# Altium schematic sheet Deploy_Switches.SchDoc: SPEX - INTERFACE - SWITCHES
size A4; Author: Derek Belsky; Revision: 0; SheetNumber: 4; SheetTotal: 6
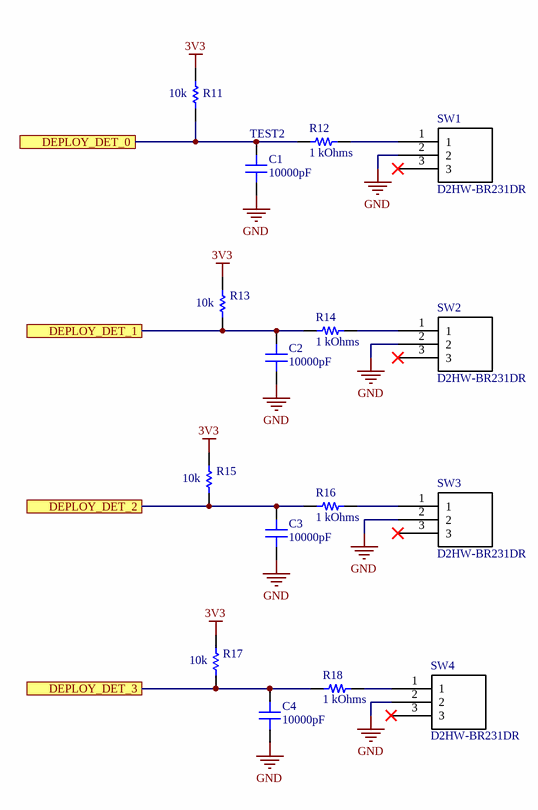
[diagram p0: Deploy_Switches.SchDoc]

## Parts
C1  10000pF  [CAP 0603_1608]
C2  10000pF  [CAP 0603_1608]
C3  10000pF  [CAP 0603_1608]
C4  10000pF  [CAP 0603_1608]
R11  value 10k  [RES 0603_1608]  (hidden comment: 1 kOhms)
R12  1 kOhms  [RES 0603_1608]
R13  value 10k  [RESC1609X50X30NL8T20]  (hidden comment: CRCW060310K0FKEA)
R14  1 kOhms  [RES 0603_1608]
R15  value 10k  [RES 0603_1608]  (hidden comment: 1 kOhms)
R16  value 1 kOhms  [RESC1609X50X30NL8T20]  (hidden comment: CRCW060310K0FKEA)
R17  value 10k  [RES 0603_1608]  (hidden comment: 1 kOhms)
R18  value 1 kOhms  [RESC1609X50X30NL8T20]  (hidden comment: CRCW060310K0FKEA)
SW1  D2HW-BR231DR
SW2  D2HW-BR231DR
SW3  D2HW-BR231DR
SW4  D2HW-BR231DR

## Ports
DEPLOY_DET_0, DEPLOY_DET_1, DEPLOY_DET_2, DEPLOY_DET_3

## Nets
3V3: R11.2 R13.2 R15.2 R17.2
GND: C1.1 C2.1 C3.1 C4.1 SW1.2 SW2.2 SW3.2 SW4.2
DEPLOY_DET_0: C1.2 R11.2 R12.1 ; port DEPLOY_DET_0
DEPLOY_DET_1: C2.2 R13.1 R14.1 ; port DEPLOY_DET_1
DEPLOY_DET_2: C3.2 R15.2 R16.1 ; port DEPLOY_DET_2
DEPLOY_DET_3: C4.2 R17.2 R18.1 ; port DEPLOY_DET_3
NetR12_2: R12.2 SW1.1
NetR14_2: R14.2 SW2.1
NetR16_2: R16.2 SW3.1
NetR18_2: R18.2 SW4.1

Not connected (* = marked no-connect by the designer): SW1 3*; SW2 3*; SW3 3*; SW4 3*

## Notes on the sheet
- (near C1) TEST2
- Title
- Size:
- Date:
- A4
- Author:
- Time:
- Sheet
- Revision:
- of
- RIT Space Exploration Team
- Rochester Institute of Technology
- 1 Lomb Memorial Drive
- Rochester, NY 14623
- https://spex.rit.edu
- File:

## Library data of the parts
C1-C4 = C0603S103K4RACTU: CAP CER 10000PF 16V X7R 0603; Manufacturer: KEMET; Tolerance: ±10%; Part Number: C0603S103K4RACTU; Value: 10000pF; Applications: Boardflex Sensitive; Capacitance: 10000pF; ComponentLink1Description: Datasheet; ComponentLink1URL: https://api.kemet.com/component-edge/download/datasheet/C0603S103K4RACTU.pdf; ComponentLink2Description: DigiKey Link; ComponentLink2URL: http://digikey.com/product-detail/en/kemet/C0603S103K4RACTU/399-9135-1-ND/3522653; Device Package: 0603 (1608 Metric); Features: Floating Electrode; LastUpdated: 1/21/2020 12:02:08 AM; Lifecycle Status: Active; Minimum Order: 1; Mounting Type: Surface Mount, MLCC; Operating Temperature: -55°C ~ 125°C; Package / Case: 0603 (1608 Metric); Packaging: TapeAndReel; PartId: 3312; Part Status: Active; Price: 0.07; Series: SMD Comm X7R FE; Size / Dimension: 0.063" L x 0.031" W (1.60mm x 0.80mm); Supplier 1: DigiKey; Supplier Part Number 1: 399-9135-1-ND; Temperature Coefficient: X7R; Thickness (Max): 0.034" (0.87mm); Voltage - Rated: 16V
R11 R13 R15 R17 = CMP-1666-00005-4: Chip Resistor, 10 KOhm, +/- 1%, 100 mW, -55 to 155 degC, 0603 (1608 Metric), RoHS, Tape and Reel; Manufacturer: Vishay Semiconductor; Voltage Rating: 75 V; Max Operating Temperature: 155 degC; PackageDescription: 2-Pin Surface Mount Device, Body 1.575 x 0.85 mm; ComponentLink1Description: Manufacturer URL; RoHSCompliant: true; PackageReference: 0603; REACH SVHC: Unknown; Length: 1.55 mm; DatasheetVersion: 06/2012; Packaging: Tape and Reel; Min Operating Temperature: -55 degC; Mounting Technology: Surface Mount; ComponentLink2URL: https://datasheet.ciiva.com/11809/0900766b80d98afc-11809037.pdf; Height: 0.45 mm; ComponentLink2Description: Datasheet; Package Quantity: 5000; ComponentLink1URL: http://www.vishay.com/
R12 R14 R16 R18 = CPF0603B1K0E: RES SMD 1K OHM 0.1% 1/16W 0603; Manufacturer: TE Connectivity Passive Product; Power (Watts): 0.063W, 1/16W; Temperature Coefficient: ±25ppm/°C; Part Number: CPF0603B1K0E; ComponentLink1Description: Datasheet; ComponentLink1URL: https://www.te.com/commerce/DocumentDelivery/DDEController?Action=srchrtrv&DocNm=1773200&DocType=DS&DocLang=English; ComponentLink2Description: DigiKey Link; ComponentLink2URL: http://digikey.com/product-detail/en/te-connectivity-passive-product/CPF0603B1K0E/A119887CT-ND/4966485; Composition: Thin Film; Device Package: 0603 (1608 Metric); Height - Seated (Max): 0.022" (0.55mm); LastUpdated: 1/21/2020 12:24:55 AM; Lifecycle Status: Active; Minimum Order: 1; Number of Terminations: 2; Operating Temperature: -55°C ~ 155°C; Package / Case: 0603 (1608 Metric); Packaging: TapeAndReel; PartId: 4877; Part Status: Active; Price: 0.09; Resistance: 1 kOhms; Series: CPF, Neohm; Size / Dimension: 0.061" L x 0.031" W (1.55mm x 0.80mm); Supplier 1: DigiKey; Supplier Part Number 1: A119887CT-ND; Supplier Device Package: 0603; Tolerance: ±0.1%
  R12 R14: Value: 1 kOhms